# Altium project MCS17.PrjPCB
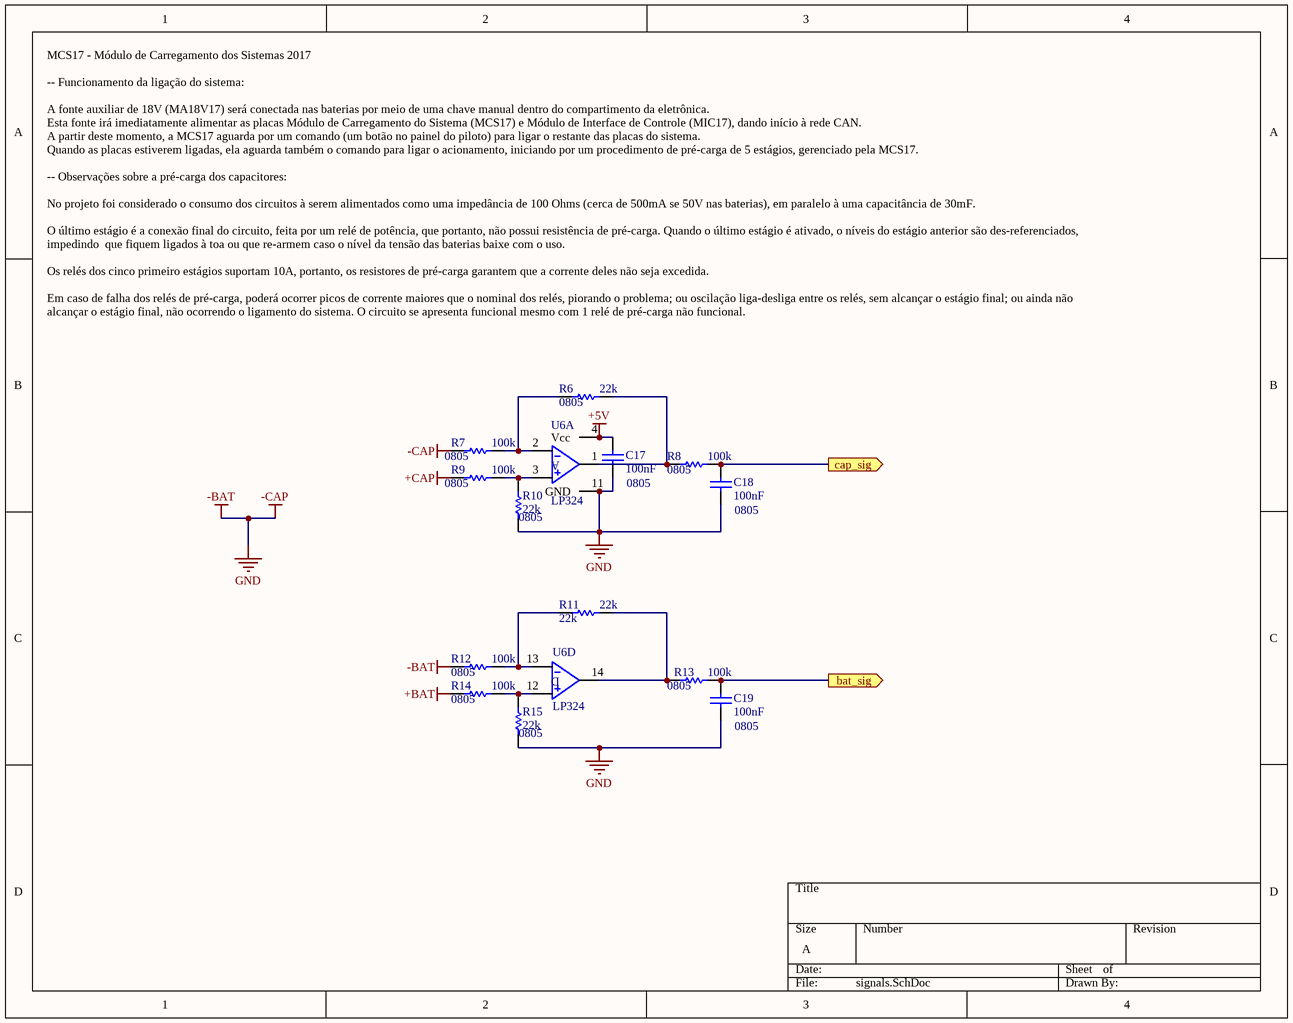
[diagram p0: signals.SchDoc]
3 sheets, 114 parts. Net scope: flat (ports and power ports of the same name join across sheets).
Board files: MCS17_sem_malha.PcbDoc, MCS17.PcbDoc
Sheets:
  signals.SchDoc
  atmega.SchDoc
  relays.SchDoc

## Sheet signals.SchDoc
size A

### Parts
C17  100nF  Footprint: 0805  [0805C]
C18  100nF  Footprint: 0805  [0805C]
C19  100nF  Footprint: 0805  [0805C]
R6  22k  Type: 0805  [0805R]
R7  100k  Type: 0805  [0805R]
R8  100k  Type: 0805  [0805R]
R9  100k  Type: 0805  [0805R]
R10  22k  Type: 0805  [0805R]
R11  22k  [0805R]
R12  100k  Type: 0805  [0805R]
R13  100k  Type: 0805  [0805R]
R14  100k  Type: 0805  [0805R]
R15  22k  Type: 0805  [0805R]
U6  LP324  [SOIC14-150(50)]  (parts A,D of 4)

### Ports
bat_sig (out), cap_sig (out)

### Nets
+5V: C17.2 U6.4(Vcc)
+BAT: R14.2
+CAP: R9.2
-BAT: C17.1 C18.1 C19.1 R7.2 R10.2 R12.2 R15.2 U6.11(GND)  [also labelled -CAP, GND]  [project net CAN_GND]
NetC18_2: C18.2 R8.1 ; port cap_sig
NetC19_2: C19.2 R13.1 ; port bat_sig
NetR6_1: R6.1 R8.2 U6.1(O1)
NetR6_2: R6.2 R7.1 U6.2(IN1-)
NetR9_1: R9.1 R10.1 U6.3(IN1+)
NetR11_1: R11.1 R13.2 U6.14(O4)
NetR11_2: R11.2 R12.1 U6.13(IN4-)
NetR14_1: R14.1 R15.1 U6.12(IN4+)

### Notes on the sheet
- MCS17 - Módulo de Carregamento dos Sistemas 2017
  -- Funcionamento da ligação do sistema:
  A fonte auxiliar de 18V (MA18V17) será conectada nas baterias por meio de uma chave manual dentro do compartimento da eletrônica.
  Esta fonte irá imediatamente alimentar as placas Módulo de Carregamento do Sistema (MCS17) e Módulo de Interface de Controle (MIC17), dando início à rede CAN.
  A partir deste momento, a MCS17 aguarda por um comando (um botão no painel do piloto) para ligar o restante das placas do sistema.
  Quando as placas estiverem ligadas, ela aguarda também o comando para ligar o acionamento, iniciando por um procedimento de pré-carga de 5 estágios, gerenciado pela MCS17.
  -- Observações sobre a pré-carga dos capacitores:
  No projeto foi considerado o consumo dos circuitos à serem alimentados como uma impedância de 100 Ohms (cerca de 500mA se 50V nas baterias), em paralelo à uma capacitância de 30mF.
  O último estágio é a conexão final do circuito, feita por um relé de potência, que portanto, não possui resistência de pré-carga. Quando o último estágio é ativado, o níveis do estágio anterior são des-referenciados, impedindo  que fiquem ligados à toa ou que re-armem caso o nível da tensão das baterias baixe com o uso.
  Os relés dos cinco primeiro estágios suportam 10A, portanto, os resistores de pré-carga garantem que a corrente deles não seja excedida.
  Em caso de falha dos relés de pré-carga, poderá ocorrer picos de corrente maiores que o nominal dos relés, piorando o problema; ou oscilação liga-desliga entre os relés, sem alcançar o estágio final; ou ainda não alcançar o estágio final, não ocorrendo o ligamento do sistema. O circuito se apresenta funcional mesmo com 1 relé de pré-carga não funcional.
- (in symbol LM324, part A) A
- (in symbol LM324, part D) D

### Library data of the parts
C17-C19 = Cap: Capacitor; Voltage: 25V; Type: pth; Value: 100nF
R6-R15 = Res1: Resistor
  R6 R10 R15: Value: 22k
  R7-R9 R12-R14: Value: 100k
  R11: Value: 22k; Type: 0805
U6 = LM324: Quadruple Operational Amplifier; Value: LP324

## Sheet atmega.SchDoc
size A4
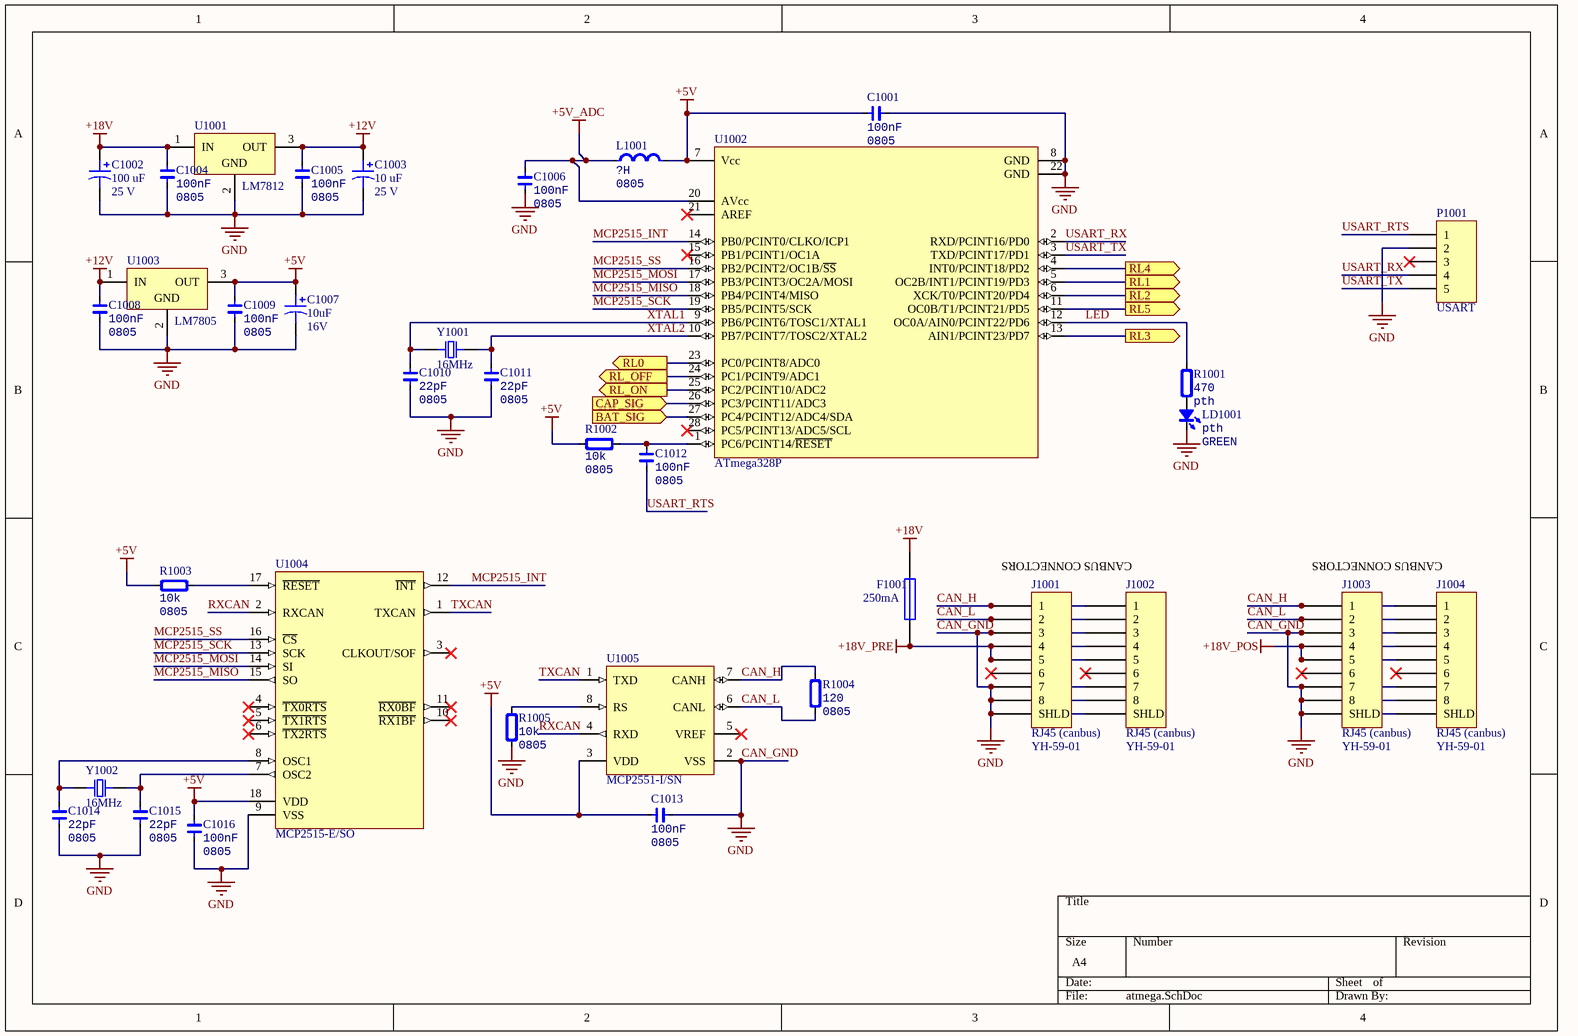
[diagram p1: atmega.SchDoc]

### Parts
C1001  Type: 0805  [0805C]  (hidden comment: 100nF)
C1002  value 100 uF  Voltage: 25 V  [CP3.5mm-8.0mm]  (hidden comment: CapacitorPol)
C1003  value 10 uF  Voltage: 25 V  [CP3.5mm-8.0mm]  (hidden comment: CapacitorPol)
C1004  Type: 0805  [0805C]  (hidden comment: 100nF)
C1005  Type: 0805  [0805C]  (hidden comment: 100nF)
C1006  Type: 0805  [0805C]  (hidden comment: 100nF)
C1007  value 10uF  Voltage: 16V  [CP3.5mm-8.0mm]  (hidden comment: CapacitorPol)
C1008  Type: 0805  [0805C]  (hidden comment: 100nF)
C1009  Type: 0805  [0805C]  (hidden comment: 100nF)
C1010  Type: 0805  [0805C]  (hidden comment: 22pF)
C1011  Type: 0805  [0805C]  (hidden comment: 22pF)
C1012  Type: 0805  [0805C]  (hidden comment: 100nF)
C1013  Type: 0805  [0805C]  (hidden comment: 100nF)
C1014  Type: 0805  [0805C]  (hidden comment: 22pF)
C1015  Type: 0805  [0805C]  (hidden comment: 22pF)
C1016  Type: 0805  [0805C]  (hidden comment: 100nF)
F1001  250mA  [Porta Fusivel]
J1001  RJ45 (canbus)  value YH-59-01  [ASSMANN A-2004-2-4-LP/FS]
J1002  RJ45 (canbus)  value YH-59-01  [ASSMANN A-2004-2-4-LP/FS]
J1003  RJ45 (canbus)  value YH-59-01  [ASSMANN A-2004-2-4-LP/FS]
J1004  RJ45 (canbus)  value YH-59-01  [ASSMANN A-2004-2-4-LP/FS]
L1001  Type: 0805  [0805L]  (hidden comment: ?H)
LD1001  Type: pth  [LED3MM]  (hidden comment: GREEN)
P1001  USART  [HDR1X5]
R1001  Type: pth  [AXIAL-0.3]  (hidden comment: 470)
R1002  Type: 0805  [0805R]  (hidden comment: 10k)
R1003  Type: 0805  [0805R]  (hidden comment: 10k)
R1004  Type: 0805  [0805R]  (hidden comment: 120)
R1005  Type: 0805  [0805R]  (hidden comment: 10k)
U1001  LM7812  [TO220_deitado]
U1002  ATmega328P  [DIP28-300(100)]
U1003  LM7805  [TO220_deitado]
U1004  MCP2515-E/SO  [WSO18_L]
U1005  MCP2551-I/SN  [SOIC08-150(50)]
Y1001  16MHz  [HC49-US-THT]
Y1002  16MHz  [HC49-US-THT]

### Ports
BAT_SIG (in), CAP_SIG (in), RL0 (out), RL1 (out), RL2 (out), RL3 (out), RL4 (out), RL5 (out), RL_OFF (out), RL_ON (out)

### Nets
+5V: C1001.1 C1007.1 C1009.2 C1013.1 C1016.1 L1001.2 R1002.1 R1003.1 U1002.7(Vcc) U1003.3(OUT) U1004.18(VDD) U1005.3(VDD)
+5V_ADC: C1006.2 L1001.1 U1002.20(AVcc)
+12V: C1003.1 C1005.2 C1008.2 U1001.3(OUT) U1003.1(IN)
+18V: C1002.1 C1004.2 F1001.1 U1001.1(IN)
+18V_POS: J1003.4 J1003.5 J1004.4 J1004.5
+18V_PRE: F1001.2 J1001.4 J1001.5 J1002.4 J1002.5
CAN_GND: C1001.2 C1002.2 C1003.2 C1004.1 C1005.1 C1006.1 C1007.2 C1008.1 C1009.1 C1010.1 C1011.1 C1013.2 C1014.1 C1015.1 C1016.2 J1001.3 J1001.7 J1001.8 J1001.S(SHLD) J1002.3 J1002.7 J1002.8 J1002.S(SHLD) J1003.3 J1003.7 J1003.8 J1003.S(SHLD) J1004.3 J1004.7 J1004.8 J1004.S(SHLD) LD1001.2(K) P1001.2 R1005.2 U1001.2(GND) U1002.8(GND) U1002.22(GND) U1003.2(GND) U1004.9(VSS) U1005.2(VSS)  [also labelled GND]
CAN_H: J1001.1 J1002.1 J1003.1 J1004.1 R1004.2 U1005.7(CANH)
CAN_L: J1001.2 J1002.2 J1003.2 J1004.2 R1004.1 U1005.6(CANL)
LED: R1001.2 U1002.12(OC0A/AIN0/PCINT22/PD6)
MCP2515_INT: U1002.14(PB0/PCINT0/CLKO/ICP1) U1004.12(~{INT})
MCP2515_MISO: U1002.18(PB4/PCINT4/MISO) U1004.15(SO)
MCP2515_MOSI: U1002.17(PB3/PCINT3/OC2A/MOSI) U1004.14(SI)
MCP2515_SCK: U1002.19(PB5/PCINT5/SCK) U1004.13(SCK)
MCP2515_SS: U1002.16(PB2/PCINT2/OC1B/~{SS}) U1004.16(~{CS})
RXCAN: U1004.2(RXCAN) U1005.4(RXD)
TXCAN: U1004.1(TXCAN) U1005.1(TXD)
USART_RTS: C1012.2 P1001.1
USART_RX: P1001.4 U1002.2(RXD/PCINT16/PD0)
USART_TX: P1001.5 U1002.3(TXD/PCINT17/PD1)
XTAL1: C1010.2 U1002.9(PB6/PCINT6/TOSC1/XTAL1) Y1001.1
XTAL2: C1011.2 U1002.10(PB7/PCINT7/TOSC2/XTAL2) Y1001.2
NetC18_2: U1002.26(PC3/PCINT11/ADC3) ; port CAP_SIG
NetC19_2: U1002.27(PC4/PCINT12/ADC4/SDA) ; port BAT_SIG
NetC1012_1: C1012.1 R1002.2 U1002.1(PC6/PCINT14/~{RESET})
NetC1014_2: C1014.2 U1004.8(OSC1) Y1002.1
NetC1015_2: C1015.2 U1004.7(OSC2) Y1002.2
NetLD1001_1: LD1001.1(A) R1001.1
NetR4_2: U1002.11(OC0B/T1/PCINT21/PD5) ; port RL5
NetR5_2: U1002.5(OC2B/INT1/PCINT19/PD3) ; port RL1
NetR16_2: U1002.6(XCK/T0/PCINT20/PD4) ; port RL2
NetR22_2: U1002.13(AIN1/PCINT23/PD7) ; port RL3
NetR23_2: U1002.4(INT0/PCINT18/PD2) ; port RL4
NetR26_2: U1002.25(PC2/PCINT10/ADC2) ; port RL_ON
NetR27_2: U1002.24(PC1/PCINT9/ADC1) ; port RL_OFF
NetR30_2: U1002.23(PC0/PCINT8/ADC0) ; port RL0
NetR1003_2: R1003.2 U1004.17(~{RESET})
NetR1005_1: R1005.1 U1005.8(RS)

Not connected (* = marked no-connect by the designer): J1001 6*; J1002 6*; J1003 6*; J1004 6*; P1001 3*; U1002 15(PB1/PCINT1/OC1A)* 21(AREF)* 28(PC5/PCINT13/ADC5/SCL)*; U1004 3(CLKOUT/SOF)* 4(~{TX0RTS})* 5(~{TX1RTS})* 6(~{TX2RTS})* 10(~{RX1BF})* 11(~{RX0BF})*; U1005 5(VREF)*

### Notes on the sheet
- CANBUS CONNECTORS

### Library data of the parts
C1001 C1004-C1006 C1008-C1016 = Cap_0805: Capacitor
  C1001 C1004-C1006 C1008 C1009 C1012 C1013 C1016: Value: 100nF
  C1010 C1011 C1014 C1015: Value: 22pF
C1002 C1003 C1007 = CapacitorPol: Solid Aluminum Capacitor with Organic Semiconductor Electrolyte: 100uF, 10V, Bulk Pack; Type: pth
F1001 = Fuse 1: Fuse; Type: 5x20; Value: 250mA
J1001-J1004 = Modular Jack with Shield: YH-59-01; Type: RJ45
L1001 = Ind_0805: Inductor; Value: ?H
LD1001 = LED_0805: LED; Value: GREEN
P1001 = Header 5: Header, 5-Pin
R1001-R1005 = Res_0805: Resistor
  R1001: Value: 470
  R1002 R1003 R1005: Value: 10k
  R1004: Value: 120
U1001 U1003 = µA7805CKC: Positive-Voltage Regulator
U1002 = ATmega328P: 8-bit AVR Microcontroller, 32KB Flash, 1KB EEPROM, 2KB SRAM, 28-pin PDIP, Industrial Grade (-40°C to 85°C)
U1004 = CMP-0186-00035-2: Stand-Alone CAN Controller With SPI Interface, 18-Pin SOIC, Extended Temperature
U1005 = CMP-1721-00003-1: High-Speed CAN Transceiver, / 1 Mb/s, 4.5 to 5.5 V, 8-Pin SOIC (SN), Industrial Temperature, RoHS, Tube
Y1001 Y1002 = Crystal: Type: pth

## Sheet relays.SchDoc
size A
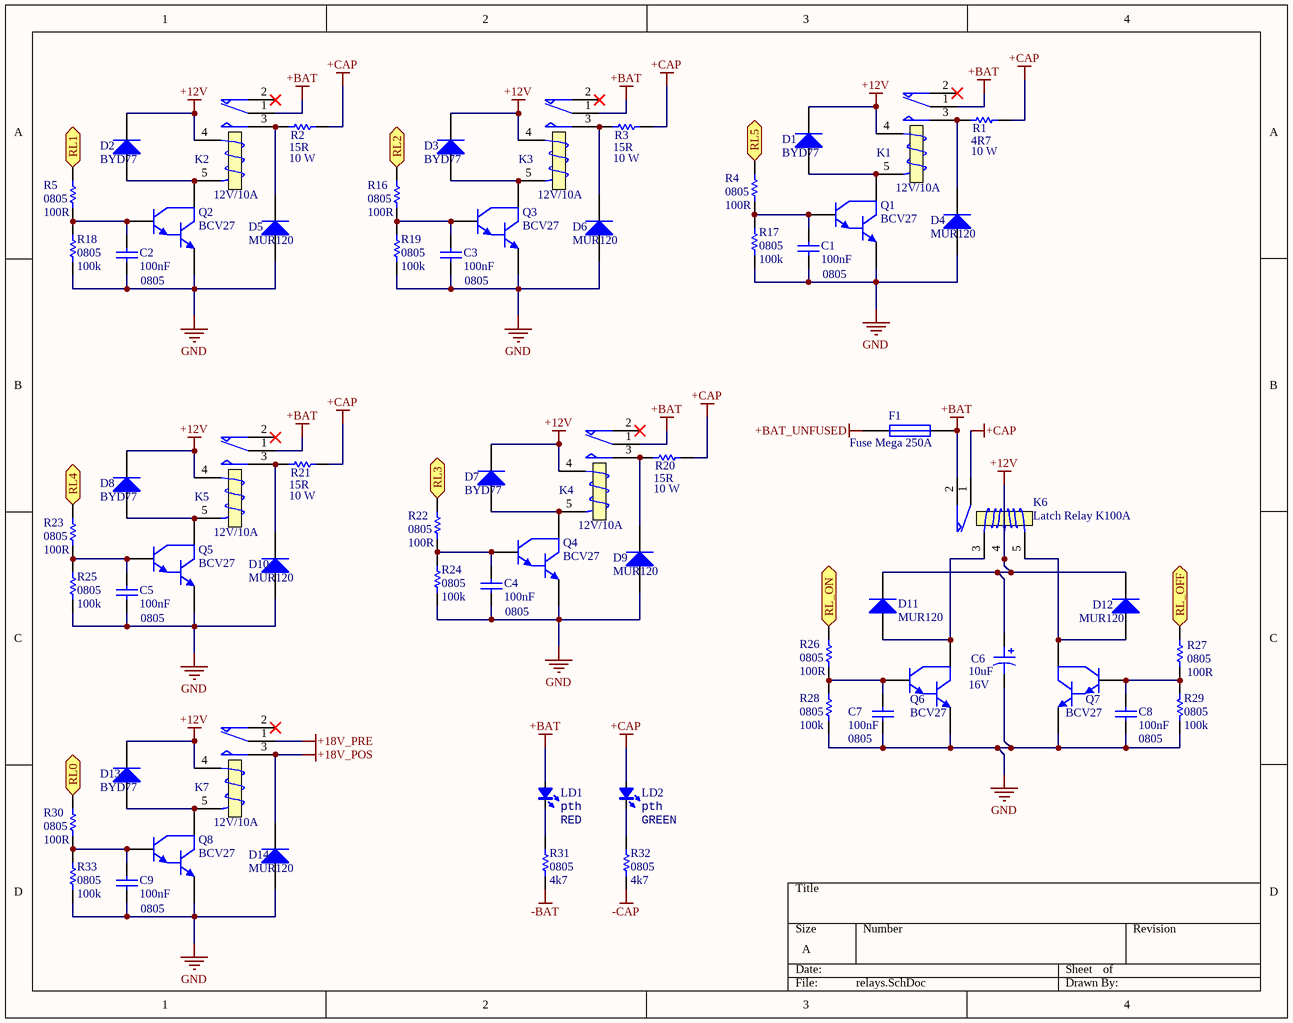
[diagram p2: relays.SchDoc]

### Parts
C1  100nF  Footprint: 0805  [0805C]
C2  100nF  Footprint: 0805  [0805C]
C3  100nF  Footprint: 0805  [0805C]
C4  100nF  Footprint: 0805  [0805C]
C5  100nF  Footprint: 0805  [0805C]
C6  Voltage: 16V  [CP3.5mm-8.0mm]  (hidden comment: 10uF)
C7  100nF  Footprint: 0805  [0805C]
C8  100nF  Footprint: 0805  [0805C]
C9  100nF  Footprint: 0805  [0805C]
D1  BYD77  [DIO10.2-7x2.7]
D2  BYD77  [DIO10.2-7x2.7]
D3  BYD77  [DIO10.2-7x2.7]
D4  MUR120  [DSO-C2/X2.3]
D5  MUR120  [DSO-C2/X2.3]
D6  MUR120  [DSO-C2/X2.3]
D7  BYD77  [DIO10.2-7x2.7]
D8  BYD77  [DIO10.2-7x2.7]
D9  MUR120  [DSO-C2/X2.3]
D10  MUR120  [DSO-C2/X2.3]
D11  MUR120  [DIO10.2-7x2.7]
D12  MUR120  [DIO10.2-7x2.7]
D13  BYD77  [DIO10.2-7x2.7]
D14  MUR120  [DSO-C2/X2.3]
F1  Fuse Mega 250A  [FuseANL]
K1  12V/10A  [RELE]
K2  12V/10A  [RELE]
K3  12V/10A  [RELE]
K4  12V/10A  [RELE]
K5  12V/10A  [RELE]
K6  Latch Relay K100A  [K100A]
K7  12V/10A  [RELE]
LD1  Type: pth  [LED3MM]  (hidden comment: RED)
LD2  Type: pth  [LED3MM]  (hidden comment: GREEN)
Q1  BCV27  [SOT95P240-3N]
Q2  BCV27  [SOT95P240-3N]
Q3  BCV27  [SOT95P240-3N]
Q4  BCV27  [SOT95P240-3N]
Q5  BCV27  [SOT95P240-3N]
Q6  BCV27  [SOT95P240-3N]
Q7  BCV27  [SOT95P240-3N]
Q8  BCV27  [SOT95P240-3N]
R1  4R7  Power: 10 W  [R-AC10]
R2  15R  Power: 10 W  [R-AC10]
R3  15R  Power: 10 W  [R-AC10]
R4  0805  value 100R  [0805R]
R5  0805  value 100R  [0805R]
R16  0805  value 100R  [0805R]
R17  0805  value 100k  [0805R]
R18  0805  value 100k  [0805R]
R19  0805  value 100k  [0805R]
R20  15R  Power: 10 W  [R-AC10]
R21  15R  Power: 10 W  [R-AC10]
R22  0805  value 100R  [0805R]
R23  0805  value 100R  [0805R]
R24  0805  value 100k  [0805R]
R25  0805  value 100k  [0805R]
R26  0805  value 100R  [0805R]
R27  0805  value 100R  [0805R]
R28  0805  value 100k  [0805R]
R29  0805  value 100k  [0805R]
R30  0805  value 100R  [0805R]
R31  0805  value 4k7  [0805R]
R32  0805  value 4k7  [0805R]
R33  0805  value 100k  [0805R]

### Ports
RL0 (in), RL1 (in), RL2 (in), RL3 (in), RL4 (in), RL5 (in), RL_OFF (in), RL_ON (in)

### Nets
+12V: C6.1 D1.2(K) D2.2(K) D3.2(K) D7.2(K) D8.2(K) D11.2(K) D12.2(K) D13.2(K) K1.4(T1) K2.4(T1) K3.4(T1) K4.4(T1) K5.4(T1) K6.4(T2) K7.4(T1)
+18V_POS: D14.2(K) K7.3(NO)
+18V_PRE: K7.1(COM)
+BAT: F1.2 K1.1(COM) K2.1(COM) K3.1(COM) K4.1(COM) K5.1(COM) K6.2(NC) LD1.1(A)
+BAT_UNFUSED: F1.1
+CAP: K6.1(COM) LD2.1(A) R1.1 R2.1 R3.1 R20.1 R21.1
-BAT: C1.1 C2.1 C3.1 C4.1 C5.1 C6.2 C7.1 C8.1 C9.1 D4.1(A) D5.1(A) D6.1(A) D9.1(A) D10.1(A) D14.1(A) Q1.3(E) Q2.3(E) Q3.3(E) Q4.3(E) Q5.3(E) Q6.3(E) Q7.3(E) Q8.3(E) R17.1 R18.1 R19.1 R24.1 R25.1 R28.1 R29.1 R31.1 R32.1 R33.1  [also labelled -CAP, GND]  [project net CAN_GND]
NetC1_2: C1.2 Q1.2(B) R4.1 R17.2
NetC2_2: C2.2 Q2.2(B) R5.1 R18.2
NetC3_2: C3.2 Q3.2(B) R16.1 R19.2
NetC4_2: C4.2 Q4.2(B) R22.1 R24.2
NetC5_2: C5.2 Q5.2(B) R23.1 R25.2
NetC7_2: C7.2 Q6.2(B) R26.1 R28.2
NetC8_2: C8.2 Q7.2(B) R27.1 R29.2
NetC9_2: C9.2 Q8.2(B) R30.1 R33.2
NetD1_1: D1.1(A) K1.5(T2) Q1.1(C)
NetD2_1: D2.1(A) K2.5(T2) Q2.1(C)
NetD3_1: D3.1(A) K3.5(T2) Q3.1(C)
NetD4_2: D4.2(K) K1.3(NO) R1.2
NetD5_2: D5.2(K) K2.3(NO) R2.2
NetD6_2: D6.2(K) K3.3(NO) R3.2
NetD7_1: D7.1(A) K4.5(T2) Q4.1(C)
NetD8_1: D8.1(A) K5.5(T2) Q5.1(C)
NetD9_2: D9.2(K) K4.3(NO) R20.2
NetD10_2: D10.2(K) K5.3(NO) R21.2
NetD11_1: D11.1(A) K6.3(T1) Q6.1(C)
NetD12_1: D12.1(A) K6.5(T3) Q7.1(C)
NetD13_1: D13.1(A) K7.5(T2) Q8.1(C)
NetLD1_2: LD1.2(K) R31.2
NetLD2_2: LD2.2(K) R32.2
NetR4_2: R4.2 ; port RL5
NetR5_2: R5.2 ; port RL1
NetR16_2: R16.2 ; port RL2
NetR22_2: R22.2 ; port RL3
NetR23_2: R23.2 ; port RL4
NetR26_2: R26.2 ; port RL_ON
NetR27_2: R27.2 ; port RL_OFF
NetR30_2: R30.2 ; port RL0

Not connected (* = marked no-connect by the designer): K1 2(NC)*; K2 2(NC)*; K3 2(NC)*; K4 2(NC)*; K5 2(NC)*; K7 2(NC)*

### Library data of the parts
C1-C5 C7-C9 = Cap: Capacitor; Voltage: 25V; Type: pth; Value: 100nF
C6 = CapacitorPol: as C1002 on sheet atmega; Value: 10uF
D1-D14 = Diode: Default Diode; Type: pth
  D1-D3 D7 D8 D13: Value: BYD77
  D4-D6 D9-D12 D14: Value: MUR120
F1 = Fuse 1: Fuse; Type: MEGA / ANL; Value: 250A
K1-K7 = Relay: SPDT Relay; Value: KRE 3; Type: KRE
LD1 LD2 = LED_0805: LED
  LD1: Value: RED
  LD2: Value: GREEN
Q1-Q8 = NPN1: NPN Darlington Bipolar Transistor; Value: BCV27
R1-R3 R20 R21 = ResistorPower: Power Resistor; Tolerance: 5%; Value: 15R 10W; Type: pth
R4 R5 R16-R19 R22-R33 = Res1: Resistor; Type: 0805

## Nets that join several sheets
+5V: signals (C17.2 U6.4), atmega (12 pins)
+12V: atmega (5 pins), relays (16 pins)
+18V_POS: atmega (J1003.4 J1003.5 J1004.4 J1004.5), relays (D14.2 K7.3)
+18V_PRE: atmega (5 pins), relays (K7.1)
+BAT: signals (R14.2), relays (8 pins)
+CAP: signals (R9.2), relays (7 pins)
CAN_GND: signals (8 pins), atmega (40 pins), relays (33 pins)
NetC18_2: signals (C18.2 R8.1), atmega (U1002.26)
NetC19_2: signals (C19.2 R13.1), atmega (U1002.27)
NetR4_2: atmega (U1002.11), relays (R4.2)
NetR5_2: atmega (U1002.5), relays (R5.2)
NetR16_2: atmega (U1002.6), relays (R16.2)
NetR22_2: atmega (U1002.13), relays (R22.2)
NetR23_2: atmega (U1002.4), relays (R23.2)
NetR26_2: atmega (U1002.25), relays (R26.2)
NetR27_2: atmega (U1002.24), relays (R27.2)
NetR30_2: atmega (U1002.23), relays (R30.2)